# Altium schematic sheet A-水泵_LCP037BK32ET8-48V-SCH-V1.2-20230321.SchDoc
size A3; SheetNumber: 1; SheetTotal: 1
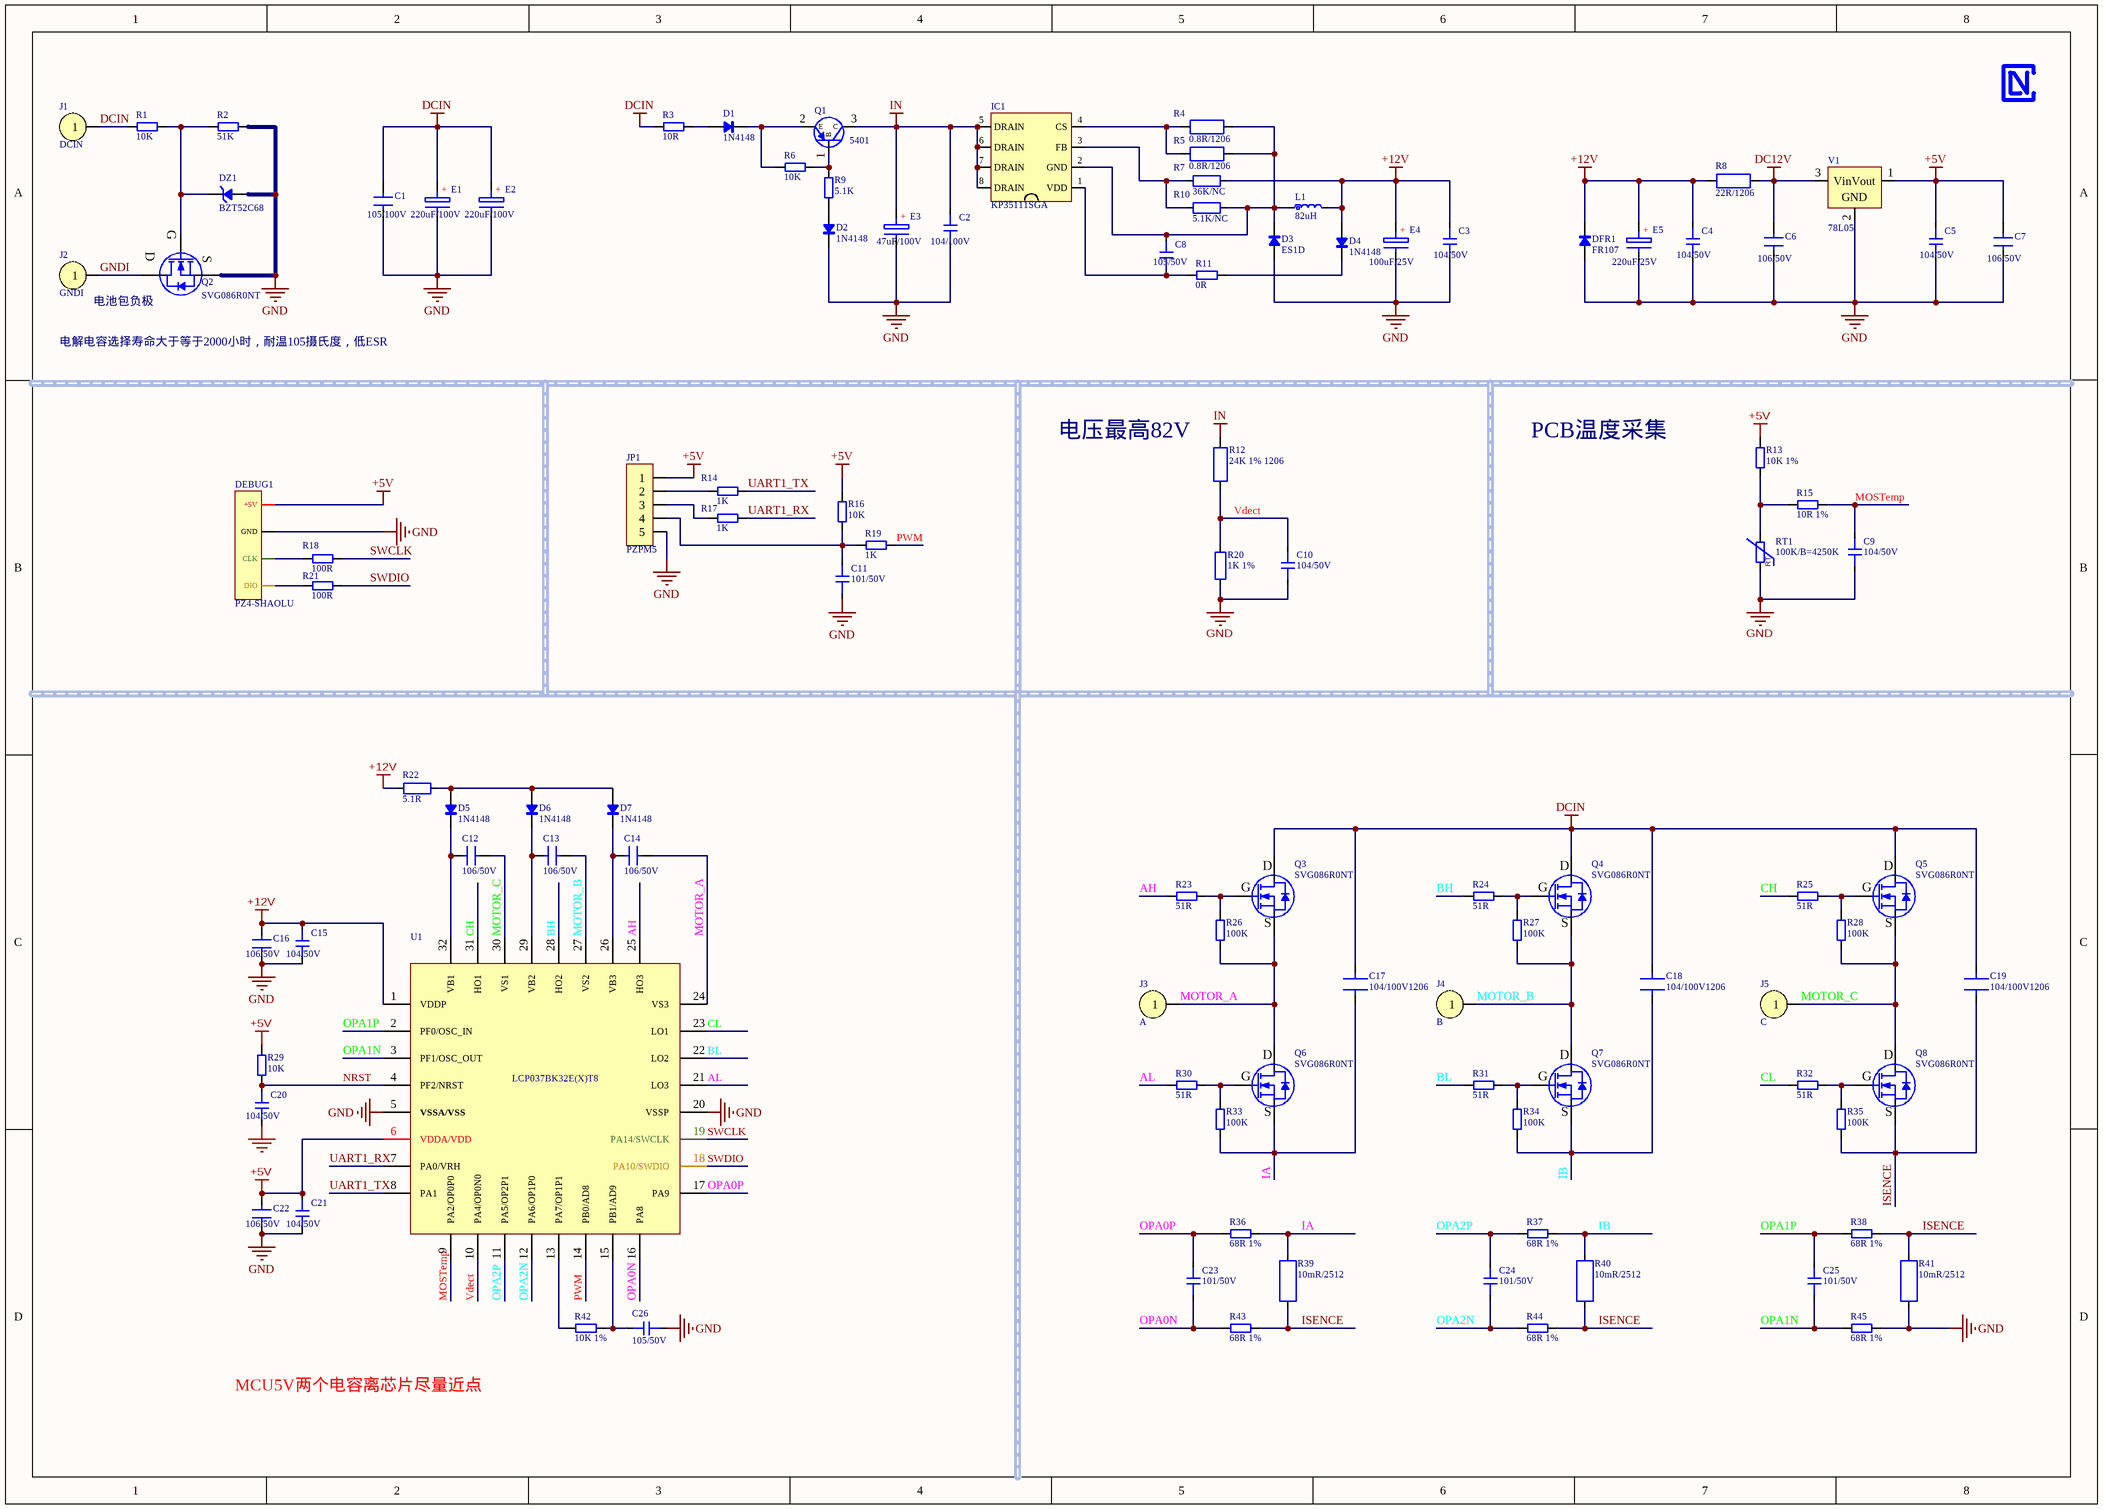
[diagram p0: A-水泵_LCP037BK32ET8-48V-SCH-V1.2-20230321.SchDoc]

## Parts
(Parts that share a designator on the sheet are numbered #1, #2 ... from top to bottom, then left to right.)
?#1  LOGO-TU  [LOGO-TU]  (value not drawn)
?#2  LOGO-ZI  [LOGO-ZI]  (value not drawn)
?#3  LOGO-MA  [LOGO-MA]  (value not drawn)
C1  105/100V  [C0805]
C2  104/100V  [C0603]
C3  104/50V  [C0603]
C4  104/50V  [C0603]
C5  104/50V  [C0603]
C6  106/50V  [C0805]
C7  106/50V  [C0805]
C8  105/50V  [C0603]
C9  104/50V  [C0603]
C10  104/50V  [C0603]
C11  101/50V  [C0603]
C12  106/50V  [C0805]
C13  106/50V  [C0805]
C14  106/50V  [C0805]
C15  104/50V  [C0603]
C16  106/50V  [C0805]
C17  104/100V1206  [C1206]
C18  104/100V1206  [C1206]
C19  104/100V1206  [C1206]
C20  104/50V  [C0603]
C21  104/50V  [C0603]
C22  106/50V  [C0805]
C23  101/50V  [C0603]
C24  101/50V  [C0603]
C25  101/50V  [C0603]
C26  105/50V  [C0603]
D1  1N4148  [SOD-123]
D2  1N4148  [SOD-123]
D3  ES1D  [SOD-123]
D4  1N4148  [SOD-123]
D5  1N4148  [SOD-123]
D6  1N4148  [SOD-123]
D7  1N4148  [SOD-123]
DEBUG1  PZ4-SHAOLU  [PZ2.54-D-4P]
DFR1  FR107  [SMA]
DZ1  BZT52C68  [SOD-123]
E1  220uF/100V  [CE-5.0-10]
E2  220uF/100V  [CE-5.0-10]
E3  47uF/100V  [CE-3.5-8]
E4  100uF/25V  [CE-2.5-5]
E5  220uF/25V  [CE-2.5-5]
IC1  KP35111SGA  [SOP-8_150_50]
J1  DCIN  [HOLD-16AWG]
J2  GNDI  [HOLD-16AWG]
J3  A  [HOLD-16AWG]
J4  B  [HOLD-16AWG]
J5  C  [HOLD-16AWG]
JP1  PZPM5  [PZ2.54-D-5P]
L1  82uH  [L-CDRH74]
Q1  5401  [SOT23-3]
Q2  SVG086R0NT  [TO220]
Q3  SVG086R0NT  [TO220]
Q4  SVG086R0NT  [TO220]
Q5  SVG086R0NT  [TO220]
Q6  SVG086R0NT  [TO220]
Q7  SVG086R0NT  [TO220]
Q8  SVG086R0NT  [TO220]
R1  10K  [R0603]
R2  51K  [R0603]
R3  10R  [R0603]
R4  0.8R/1206  [R1206]
R5  0.8R/1206  [R1206]
R6  10K  [R0603]
R7  36K/NC  [R0805]
R8  22R/1206  [R1206]
R9  5.1K  [R0603]
R10  5.1K/NC  [R0805]
R11  0R  [R0603]
R12  24K 1% 1206  [R1206]
R13  10K 1%  [R0603]
R14  1K  [R0603]
R15  10R 1%  [R0603]
R16  10K  [R0603]
R17  1K  [R0603]
R18  100R  [R0603]
R19  1K  [R0603]
R20  1K 1%  [R0805]
R21  100R  [R0603]
R22  5.1R  [R0805]
R23  51R  [R0603]
R24  51R  [R0603]
R25  51R  [R0603]
R26  100K  [R0603]
R27  100K  [R0603]
R28  100K  [R0603]
R29  10K  [R0603]
R30  51R  [R0603]
R31  51R  [R0603]
R32  51R  [R0603]
R33  100K  [R0603]
R34  100K  [R0603]
R35  100K  [R0603]
R36  68R 1%  [R0603]
R37  68R 1%  [R0603]
R38  68R 1%  [R0603]
R39  10mR/2512  [R2512]
R40  10mR/2512  [R2512]
R41  10mR/2512  [R2512]
R42  10K 1%  [R0603]
R43  68R 1%  [R0603]
R44  68R 1%  [R0603]
R45  68R 1%  [R0603]
RT1  100K/B=4250K  [NTC-S-0603]
U1  LCP037BK32E(X)T8  [LNCP-LQFP32-7X7-0.8]
V1  78L05  [SOT89]

## Nets
+5V: C5.1 C7.1 C21.1 C22.1 DEBUG1.1(+5V) JP1.1 R13.2 R16.2 R29.2 U1.6(VDDA/VDD) V1.1(Vout)
+12V: C3.1 C4.1 C15.1 C16.1 D4.1(A) DFR1.2(K) E4.1 E5.1 L1.2 R7.2 R8.1 R22.1 U1.1(VDDP)
DC12V: C6.1 R8.2 V1.3(Vin)
DCIN: C1.1 C17.1 C18.1 C19.1 E1.1 E2.1 J1.1 Q3.2(D) Q4.2(D) Q5.2(D) R1.1 R3.1
GND: C1.2 C2.2 C3.2 C4.2 C5.2 C6.2 C7.2 C9.2 C10.2 C11.2 C15.2 C16.2 C20.2 C21.2 C22.2 C26.2 D2.2(K) D3.1(A) DEBUG1.2(GND) DFR1.1(A) DZ1.1(A) E1.2 E2.2 E3.2 E4.2 E5.2 JP1.5 Q2.3(S) R2.2 R20.1 R41.1 R45.2 RT1.1 U1.5(VSSA/VSS) U1.20(VSSP) V1.2(GND)
IN: C2.1 E3.1 IC1.5(DRAIN) IC1.6(DRAIN) IC1.7(DRAIN) IC1.8(DRAIN) Q1.3(C) R12.2
AH: R23.1 U1.25(HO3)
AL: R30.1 U1.21(LO3)
BH: R24.1 U1.28(HO2)
BL: R31.1 U1.22(LO2)
CH: R25.1 U1.31(HO1)
CL: R32.1 U1.23(LO1)
GNDI: J2.1 Q2.2(D)
IA: C17.2 Q6.3(S) R33.1 R36.2 R39.2
IB: C18.2 Q7.3(S) R34.1 R37.2 R40.2
ISENCE: C19.2 Q8.3(S) R35.1 R38.2 R39.1 R40.1 R41.2 R43.2 R44.2
MOSTemp: C9.1 R15.1 U1.9(PA2/OP0P0)
MOTOR_A: C14.2 J3.1 Q3.3(S) Q6.2(D) R26.1 U1.24(VS3)
MOTOR_B: C13.2 J4.1 Q4.3(S) Q7.2(D) R27.1 U1.27(VS2)
MOTOR_C: C12.2 J5.1 Q5.3(S) Q8.2(D) R28.1 U1.30(VS1)
NRST: C20.1 R29.1 U1.4(PF2/NRST)
OPA0N: C23.2 R43.1 U1.16(PA8)
OPA0P: C23.1 R36.1 U1.17(PA9)
OPA1N: C25.2 R45.1 U1.3(PF1/OSC_OUT)
OPA1P: C25.1 R38.1 U1.2(PF0/OSC_IN)
OPA2N: C24.2 R44.1 U1.12(PA6/OP1P0)
OPA2P: C24.1 R37.1 U1.11(PA5/OP2P1)
PWM: R19.2 U1.14(PB0/AD8)
SWCLK: R18.2 U1.19(PA14/SWCLK)
SWDIO: R21.2 U1.18(PA10/SWDIO)
UART1_RX: R17.2 U1.7(PA0/VRH)
UART1_TX: R14.2 U1.8(PA1)
Vdect: C10.1 R12.1 R20.2 U1.10(PA4/OP0N0)
NetC8_1: C8.1 D3.2(K) IC1.2(GND) L1.1 R4.2 R5.2 R10.2
NetC8_2: C8.2 IC1.1(VDD) R11.2
NetC11_1: C11.1 JP1.4 R16.1 R19.1
NetC12_1: C12.1 D5.2(K) U1.32(VB1)
NetC13_1: C13.1 D6.2(K) U1.29(VB2)
NetC14_1: C14.1 D7.2(K) U1.26(VB3)
NetC26_1: C26.1 R42.1 U1.15(PB1/AD9)
NetD1_1: D1.1(A) R3.2
NetD1_2: D1.2(K) Q1.2(E) R6.1
NetD2_1: D2.1(A) R9.1
NetD4_2: D4.2(K) R11.1
NetD5_1: D5.1(A) D6.1(A) D7.1(A) R22.2
NetDEBUG1_3: DEBUG1.3(CLK) R18.1
NetDEBUG1_4: DEBUG1.4(DIO) R21.1
NetDZ1_2: DZ1.2(K) Q2.1(G) R1.2 R2.1
NetIC1_3: IC1.3(FB) R7.1 R10.1
NetIC1_4: IC1.4(CS) R4.1 R5.1
NetJP1_2: JP1.2 R14.1
NetJP1_3: JP1.3 R17.1
NetQ1_1: Q1.1(B) R6.2 R9.2
NetQ3_1: Q3.1(G) R23.2 R26.2
NetQ4_1: Q4.1(G) R24.2 R27.2
NetQ5_1: Q5.1(G) R25.2 R28.2
NetQ6_1: Q6.1(G) R30.2 R33.2
NetQ7_1: Q7.1(G) R31.2 R34.2
NetQ8_1: Q8.1(G) R32.2 R35.2
NetR13_1: R13.1 R15.2 RT1.2
NetR42_2: R42.2 U1.13(PA7/OP1P1)

## Notes on the sheet
- (near J2) 电池包负极
- 电解电容选择寿命大于等于2000小时，耐温105摄氏度，低ESR
- 电压最高82V
- PCB温度采集
- MCU5V两个电容离芯片尽量近点
- (in symbol A_CAP_CE_DIP) +
- (in symbol A_RES_NTC_SMD) RT

## Library data of the parts
C1 C6 C7 C12-C14 C16 C22 = A_CAP_8: 0805; BOM名称: 无极性贴片电容
C2-C5 C8-C11 C15 C20 C21 C23-C26 = A_CAP_6: 0603; BOM名称: 无极性贴片电容
C17-C19 = A_CAP_12: 1206/1808; BOM名称: 无极性贴片电容
D1-D7 = DIO: 二极管/高效率/通用
DEBUG1 = PZ4-SHAOLU: 烧录口; BOM名称: 4P连接器
DFR1 = DIO_FR(E)D: 快/超快恢复二极管; BOM名称: 快恢复二极管
DZ1 = DIO_ZENER: 稳压管
E1-E5 = A_CAP_CE_DIP: 直插电解电容
IC1 = IC_DY_KP35111: 功率电子开关/BUCK_DC-DC
J1-J5 = CON_DIP: 直插孔
JP1 = PZPM5: 排针排母; BOM名称: 5P连接器
L1 = INDUCTOR: 贴片电感; BOM名称: 小功率贴片电感
Q1 = D_BJT_N: PNP三极管; Parameter 1: 9015; Parameter 3: S8550; Parameter 2: 5401
Q2-Q8 = D_MOS_N-2D/: N沟道; BOM名称: N沟道场效应管
R1-R3 R6 R9 R11 R13-R19 R21 R23-R38 R42-R45 = A_RES_6: 0603; BOM名称: 贴片电阻
R4 R5 R8 R12 = A_RES_12: 1206; BOM名称: 贴片电阻
R7 R10 R20 R22 = A_RES_8: 0805; BOM名称: 贴片电阻
R39-R41 = A_RES_25: 2512; BOM名称: 贴片电阻
RT1 = A_RES_NTC_SMD: 热敏电阻
U1 = MCU_电机_32位_037_B1: 037合封BK32E(X)T8; PCB DECAL: LQFP-32
V1 = LDO_2D/: BUCK_DC-DC; BOM名称: 线性稳压芯片